# Altium schematic sheet P04_POWER.SchDoc
size 420 x 297 mm
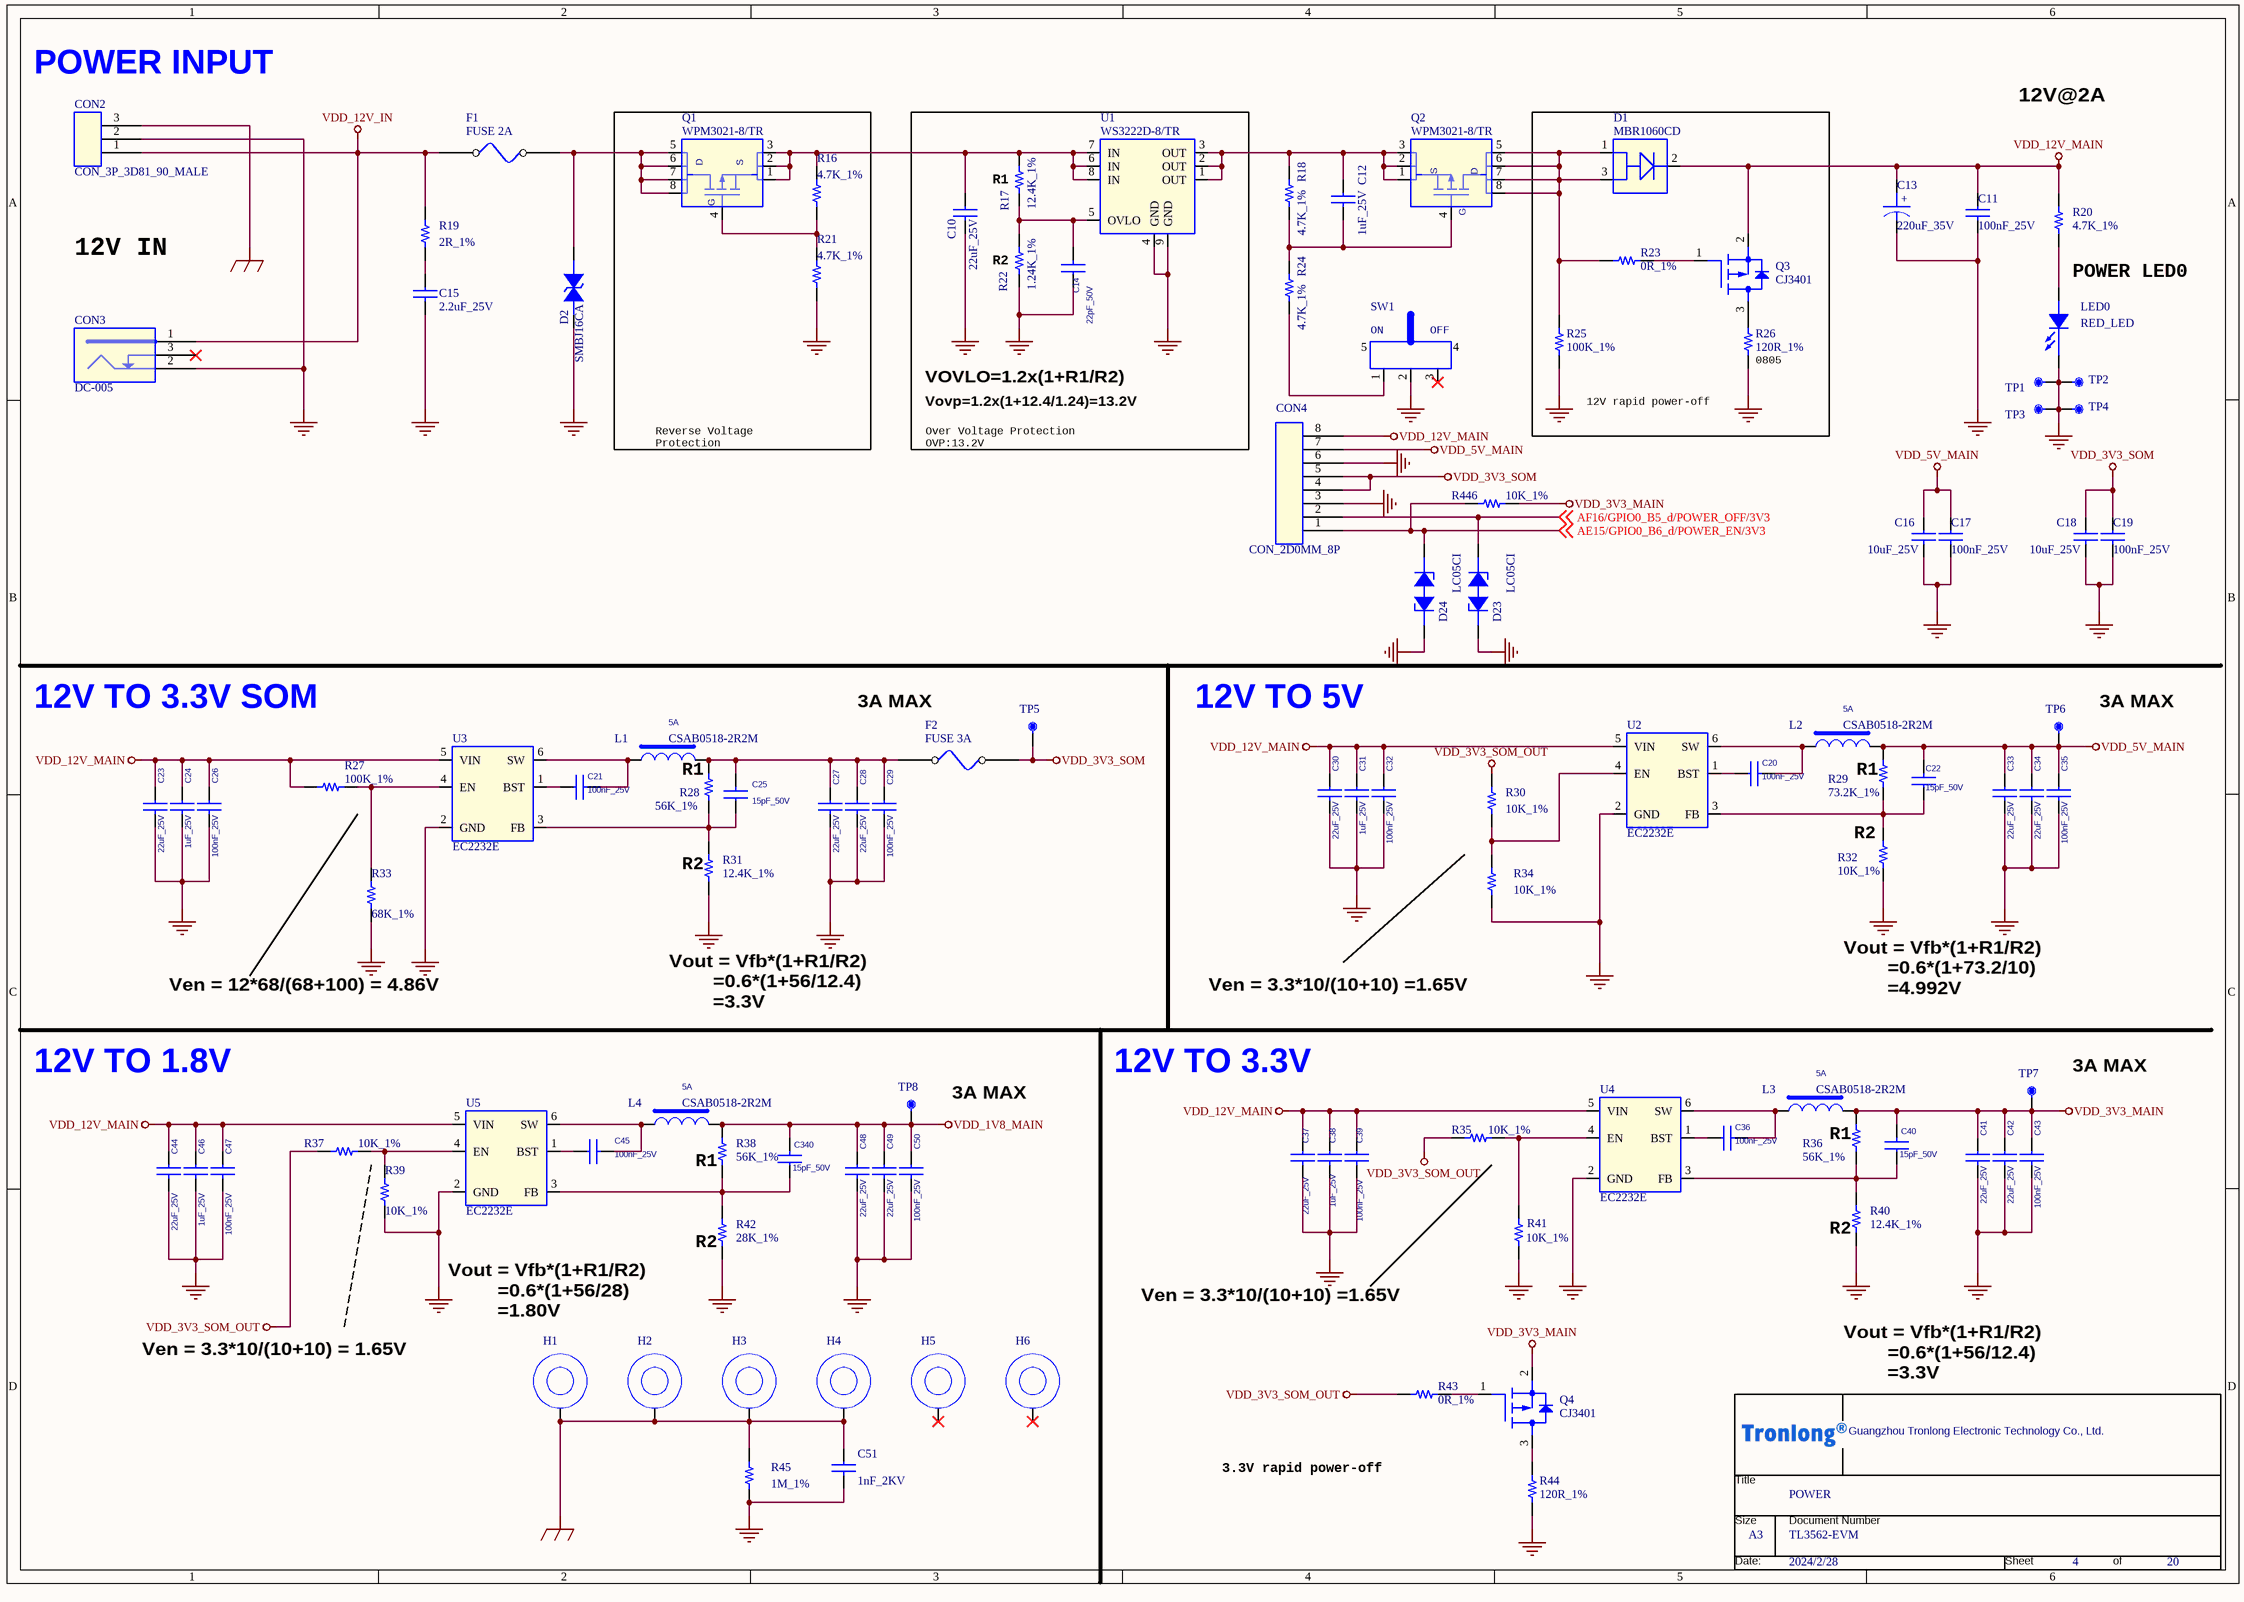
[diagram p0: P04_POWER.SchDoc]

## Parts
*  Page Count: 20  Page Number: 4  Page Size: A3  OrgName: Guangzhou Tronlong Electronic Technology Co., Ltd.  Title: POWER  Doc: TL3562-EVM  Page Modify Date: 2024/2/28  (hidden comment: Tronlong_TITTLE_20211115)  (graphical)
C10  22uF_25V  [C0805]
C11  100nF_25V  [C0402]
C12  1uF_25V  [C0603]
C13  220uF_35V  [cap_alu_smd_8x10d5]
C14  22pF_50V  [C0603]
C15  2.2uF_25V  [C1206]
C16  10uF_25V  [C0603]
C17  100nF_25V  [C0402]
C18  10uF_25V  [C0603]
C19  100nF_25V  [C0402]
C20  100nF_25V  [C0402]
C21  100nF_25V  [C0402]
C22  15pF_50V  [C0402]
C23  22uF_25V  [C0805]
C24  1uF_25V  [C0603]
C25  15pF_50V  [C0402]
C26  100nF_25V  [C0402]
C27  22uF_25V  [C0805]
C28  22uF_25V  [C0805]
C29  100nF_25V  [C0402]
C30  22uF_25V  [C0805]
C31  1uF_25V  [C0603]
C32  100nF_25V  [C0402]
C33  22uF_25V  [C0805]
C34  22uF_25V  [C0805]
C35  100nF_25V  [C0402]
C36  100nF_25V  [C0402]
C37  22uF_25V  [C0805]
C38  1uF_25V  [C0603]
C39  100nF_25V  [C0402]
C40  15pF_50V  [C0402]
C41  22uF_25V  [C0805]
C42  22uF_25V  [C0805]
C43  100nF_25V  [C0402]
C44  22uF_25V  [C0805]
C45  100nF_25V  [C0402]
C46  1uF_25V  [C0603]
C47  100nF_25V  [C0402]
C48  22uF_25V  [C0805]
C49  22uF_25V  [C0805]
C50  100nF_25V  [C0402]
C51  1nF_2KV  [C1210]
C340  15pF_50V  [C0402]
CON2  CON_3P_3D81_90_MALE  [CON_3P_3D81_90_MALE_NEW]
CON3  DC-005  [con_dc005_new]
CON4  CON_2D0MM_8P  [DIP_CON_2D0MM_8P]
D1  MBR1060CD  [TO-252]
D2  SMBJ16CA  [SMB]
D23  LC05CI  [SOD323_BI]
D24  LC05CI  [SOD323_BI]
F1  FUSE 2A  [F1206]
F2  FUSE 3A  [F1206]
H1  HOLE  [MHOLE_C200D125]  (value not drawn)
H2  HOLE  [MHOLE_C200D125]  (value not drawn)
H3  HOLE  [MHOLE_C200D125]  (value not drawn)
H4  HOLE  [MHOLE_C200D125]  (value not drawn)
H5  HOLE  [MHOLE_C200D125]  (value not drawn)
H6  HOLE  [MHOLE_C200D125]  (value not drawn)
L1  CSAB0518-2R2M  Current: 5A  [SMD_CSAB0518]
L2  CSAB0518-2R2M  Current: 5A  [SMD_CSAB0518]
L3  CSAB0518-2R2M  Current: 5A  [SMD_CSAB0518]
L4  CSAB0518-2R2M  Current: 5A  [SMD_CSAB0518]
LED0  RED_LED  [CON_2P_3MM]
Q1  WPM3021-8/TR  [PSOPSOP-8L]
Q2  WPM3021-8/TR  [PSOPSOP-8L]
Q3  CJ3401  [SOT23-3]
Q4  CJ3401  [SOT23-3]
R16  4.7K_1%  [R0402]
R17  12.4K_1%  [R0402]
R18  4.7K_1%  [R0402]
R19  2R_1%  [R1210]
R20  4.7K_1%  [R0402]
R21  4.7K_1%  [R0402]
R22  1.24K_1%  [R0603]
R23  0R_1%  [R0402]
R24  4.7K_1%  [R0402]
R25  100K_1%  [R0402]
R26  120R_1%  [R0805]
R27  100K_1%  [R0402]
R28  56K_1%  [R0402]
R29  73.2K_1%  [R0402]
R30  10K_1%  [R0402]
R31  12.4K_1%  [R0402]
R32  10K_1%  [R0402]
R33  68K_1%  [R0402]
R34  10K_1%  [R0402]
R35  10K_1%  [R0402]
R36  56K_1%  [R0402]
R37  10K_1%  [R0402]
R38  56K_1%  [R0402]
R39  10K_1%  [R0402]
R40  12.4K_1%  [R0402]
R41  10K_1%  [R0402]
R42  28K_1%  [R0402]
R43  0R_1%  [R0402]
R44  120R_1%  [R0805]
R45  1M_1%  [R0603]
R446  10K_1%  [R0402]
SW1  SS-12D11L5  [sw-126_76]  (value not drawn)
TP1  Black Test Point  [TP_DIP]  (value not drawn)
TP2  Black Test Point  [TP_DIP]  (value not drawn)
TP3  Black Test Point  [TP_DIP]  (value not drawn)
TP4  Black Test Point  [TP_DIP]  (value not drawn)
TP5  SMT TP  [TP30]  (value not drawn)
TP6  SMT TP  [TP30]  (value not drawn)
TP7  SMT TP  [TP30]  (value not drawn)
TP8  SMT TP  [TP30]  (value not drawn)
U1  WS3222D-8/TR  [DFN2X2-8L]
U2  EC2232E  [SOT-23-6L]
U3  EC2232E  [SOT-23-6L]
U4  EC2232E  [SOT-23-6L]
U5  EC2232E  [SOT-23-6L]

## Blocks framed on the sheet
VOVLO=1.2x(1+R1/R2): C10 C14 R17 R22 U1

## Nets
EGND: C51.1 CON2.3 H1.1 H2.1 H3.1 H4.1 R45.1
GND: C10.2 C11.2 C13.2 C14.1 C15.2 C16.2 C17.2 C18.2 C19.2 C23.2 C24.2 C26.2 C27.2 C28.2 C29.2 C30.2 C31.2 C32.2 C33.2 C34.2 C35.2 C37.2 C38.2 C39.2 C41.2 C42.2 C43.2 C44.2 C46.2 C47.2 C48.2 C49.2 C50.2 C51.2 CON2.2 CON3.2 CON4.3 CON4.6 D2.1 D23.2(CATHODE2) D24.2(CATHODE2) LED0.2(CATHODE) R21.1 R22.2 R25.1 R26.2 R31.1 R32.1 R33.1 R34.1 R39.1 R40.1 R41.1 R42.1 R44.2 R45.2 SW1.2 TP1.1 TP2.1 TP3.1 TP4.1 U1.4(GND) U1.9(GND) U2.2(GND) U3.2(GND) U4.2(GND) U5.2(GND)
VDD_1V8_MAIN: C48.1 C49.1 C50.1 C340.2 L4.2 R38.2 TP8.1
VDD_3V3_MAIN: C40.2 C41.1 C42.1 C43.1 L3.2 Q4.2(SOURCE) R36.2 R446.1 TP7.1
VDD_3V3_SOM: C18.1 C19.1 CON4.4 CON4.5 F2.2 TP5.1
VDD_3V3_SOM_OUT: R30.2 R35.2 R37.1 R43.2
VDD_5V_MAIN: C16.1 C17.1 C22.2 C33.1 C34.1 C35.1 CON4.7 L2.2 R29.2 TP6.1
VDD_12V_IN: CON2.1 CON3.1 F1.1 R19.2
VDD_12V_MAIN: C11.1 C13.1 C23.1 C24.1 C26.1 C30.1 C31.1 C32.1 C37.1 C38.1 C39.1 C44.1 C46.1 C47.1 CON4.8 D1.2 Q3.2(SOURCE) R20.1 R27.1 U2.5(VIN) U3.5(VIN) U4.5(VIN) U5.5(VIN)
AE15/GPIO0_B6_d/POWER_EN/3V3: CON4.1 D24.1(ANODE1) R446.2 ; off-sheet AE15/GPIO0_B6_d/POWER_EN/3V3
AF16/GPIO0_B5_d/POWER_OFF/3V3: CON4.2 D23.1(ANODE1) ; off-sheet AF16/GPIO0_B5_d/POWER_OFF/3V3
NetC10_1: C10.1 Q1.1(S1) Q1.2(S2) Q1.3(S3) R16.2 R17.1 U1.6(IN) U1.7(IN) U1.8(IN)
NetC12_1: C12.1 Q2.1(S1) Q2.2(S2) Q2.3(S3) R18.2 U1.1(OUT) U1.2(OUT) U1.3(OUT)
NetC12_2: C12.2 Q2.4(G) R18.1 R24.2
NetC14_2: C14.2 R17.2 R22.1 U1.5(OVLO)
NetC15_1: C15.1 R19.1
NetC20_1: C20.1 U2.1(BST)
NetC20_2: C20.2 L2.1 U2.6(SW)
NetC21_1: C21.1 U3.1(BST)
NetC21_2: C21.2 L1.1 U3.6(SW)
NetC22_1: C22.1 R29.1 R32.2 U2.3(FB)
NetC25_1: C25.1 R28.1 R31.2 U3.3(FB)
NetC25_2: C25.2 C27.1 C28.1 C29.1 F2.1 L1.2 R28.2
NetC36_1: C36.1 U4.1(BST)
NetC36_2: C36.2 L3.1 U4.6(SW)
NetC40_1: C40.1 R36.1 R40.2 U4.3(FB)
NetC45_1: C45.1 U5.1(BST)
NetC45_2: C45.2 L4.1 U5.6(SW)
NetC340_1: C340.1 R38.1 R42.2 U5.3(FB)
NetD1_1: D1.1 D1.3 Q2.5(D1) Q2.6(D2) Q2.7(D3) Q2.8(D4) R23.2 R25.2
NetD2_2: D2.2 F1.2 Q1.5(D1) Q1.6(D2) Q1.7(D3) Q1.8(D4)
NetLED0_1: LED0.1(ANODE) R20.2
NetQ1_4: Q1.4(G) R16.1 R21.2
NetQ3_1: Q3.1(GATE) R23.1
NetQ3_3: Q3.3(DRAIN) R26.1
NetQ4_1: Q4.1(GATE) R43.1
NetQ4_3: Q4.3(DRAIN) R44.1
NetR24_1: R24.1 SW1.1
NetR27_2: R27.2 R33.2 U3.4(EN)
NetR30_1: R30.1 R34.2 U2.4(EN)
NetR35_1: R35.1 R41.2 U4.4(EN)
NetR37_2: R37.2 R39.2 U5.4(EN)

Not connected (* = marked no-connect by the designer): CON3 3*; H5 1*; H6 1*; SW1 3* 4 5

## Notes on the sheet
- (near CON2) POWER INPUT
- 12V@2A
- (near R17) R1
- 12V IN
- (near R22) R2
- POWER LED0
- (near R26) 0805
- Reverse Voltage
  Protection
- Over Voltage Protection
  OVP:13.2V
- Vovp=1.2x(1+12.4/1.24)=13.2V
- 12V rapid power-off
- 12V TO 3.3V SOM
- 3A MAX
- 12V TO 5V
- (near TP6) 3A MAX
- (near L1) R1
- R1
- (near R32) R2
- (near R31) R2
- Ven = 12*68/(68+100) = 4.86V
- Ven = 3.3*10/(10+10) =1.65V
- Vout = Vfb*(1+R1/R2)
  =0.6*(1+73.2/10)
  =4.992V
- Vout = Vfb*(1+R1/R2)
  =0.6*(1+56/12.4)
  =3.3V
- (near TP7) 3A MAX
- 12V TO 1.8V
- (near TP8) 3A MAX
- 12V TO 3.3V
- (near R38) R1
- (near R42) R2
- (near R40) R2
- (near R42) Vout = Vfb*(1+R1/R2)
  =0.6*(1+56/28)
  =1.80V
- Ven = 3.3*10/(10+10) = 1.65V
- 3.3V rapid power-off
- (in symbol CAP POL_Dup1) +
- (in symbol switch_7) ON; OFF
- (in symbol Tronlong_TITTLE_20211115) Title; Size; Document Number; Date:; Sheet; of
- (in symbol WPM3021) S; D

## Library data of the parts
* = Tronlong_TITTLE_20211115: RevCode: A?; Page Create Date: March  8, 1995
C10 C37 C41 C42 = CAP NP_Dup3: 贴片陶瓷电容,22uF,20%,25V,X5R; Manufacturer Character: 中国大陆; Operation Temperature（℃）: -55~85℃; As-Welded: /; Temperature: -55~125℃; PCB Footprint: C0805
C11 = CAP NP_Dup3: 贴片陶瓷电容,100nF,10%,25V,X5R; Manufacturer Character: 中国大陆; As-Welded: /; Operation Temperature（℃）: -55~85℃; room: DCIN; Temperature: -55~125℃; PCB Footprint: C0402
C12 C38 = CAP NP_Dup3: 贴片陶瓷电容,1uF,10%,25V,X5R; Manufacturer Character: 中国大陆; As-Welded: /; Operation Temperature（℃）: -55~85℃; PCB Footprint: C0603
C13 = CAP POL_Dup1: 贴片式铝电解电容,220uF,20%,35V; Manufacturer PartNumber: RVT1V221M0810VG; Manufacturer: 东莞市合粤电子有限公司（Heyue）; Manufacturer Character: 中国大陆; As-Welded: /; room: DCIN; Operation Temperature（℃）: -55~105℃; Temperature: -55~105℃; PCB Footprint: cap_alu_smd_8x10d5
C14 = CAP NP_Dup3: 贴片陶瓷电容,22pF,5%,50V,C0G; Manufacturer Character: 中国大陆; As-Welded: /; Operation Temperature（℃）: -55~125℃; Temperature: -55~125℃; PCB Footprint: C0603
C15 = CAP NP_Dup3: 贴片陶瓷电容,2.2uF,20%,25V,Y5V; Manufacturer Character: 中国大陆; As-Welded: /; Operation Temperature（℃）: -20~85℃; PCB Footprint: C1206
C16 C18 = CAP NP_Dup3: 贴片陶瓷电容,10uF,10%,10V,X5R; Manufacturer Character: 中国大陆; As-Welded: /; Operation Temperature（℃）: -55~85℃; PCB Footprint: C0603
C17 C19-C21 C26 C29 C32 C35 = CAP NP_Dup3: 贴片陶瓷电容,100nF,10%,25V,X5R; Manufacturer Character: 中国大陆; Operation Temperature（℃）: -55~85℃; As-Welded: /; PCB Footprint: C0402
  C20 C21 C26 C29 C32 C35: Temperature: -55~125℃
C22 C25 C340 = CAP NP_Dup3: 贴片陶瓷电容,15pF,5%,50V,COG; Manufacturer Character: 中国大陆; Operation Temperature（℃）: -55~125℃; As-Welded: /; Temperature: -55~125℃; PCB Footprint: C0402
C23 C27 C28 C30 C33 C34 C48 C49 = CAP NP_Dup3: 贴片陶瓷电容,22uF,20%,25V,X5R; Manufacturer Character: 中国大陆; As-Welded: /; Operation Temperature（℃）: -55~85℃; Temperature: -55~125℃; PCB Footprint: C0805
C24 C31 = CAP NP_Dup3: 贴片陶瓷电容,1uF,10%,25V,X5R; Manufacturer Character: 中国大陆; Operation Temperature（℃）: -55~85℃; As-Welded: /; PCB Footprint: C0603
C36 C39 C43 = CAP NP_Dup3: 贴片陶瓷电容,100nF,10%,25V,X5R; Manufacturer Character: 中国大陆; As-Welded: /; Operation Temperature（℃）: -55~85℃; Temperature: -55~125℃; PCB Footprint: C0402
C40 = CAP NP_Dup3: 贴片陶瓷电容,15pF,5%,50V,COG; Manufacturer Character: 中国大陆; As-Welded: /; Operation Temperature（℃）: -55~125℃; PCB Footprint: C0402; Temperature: -55~125℃
C44 = CAP NP_Dup3: 贴片陶瓷电容,22uF,20%,25V,X5R; Manufacturer Character: 中国大陆; Operation Temperature（℃）: -55~85℃; Characteristic: <Characteristic>; As-Welded: /; Temperature: -55~155℃; PCB Footprint: C0805
C45 C47 = CAP NP_Dup3: 贴片陶瓷电容,100nF,10%,25V,X5R; Manufacturer Character: 中国大陆; As-Welded: /; Operation Temperature（℃）: -55~85℃; Characteristic: <Characteristic>; Temperature: -55~155℃; PCB Footprint: C0402
C46 = CAP NP_Dup3: 贴片陶瓷电容,1uF,10%,25V,X5R; Manufacturer Character: 中国大陆; As-Welded: /; Characteristic: <Characteristic>; Operation Temperature（℃）: -55~85℃; PCB Footprint: C0603
C50 = CAP NP_Dup3: 贴片陶瓷电容,100nF,10%,25V,X5R; Manufacturer Character: 中国大陆; Characteristic: <Characteristic>; Operation Temperature（℃）: -55~85℃; As-Welded: /; Temperature: -55~155℃; PCB Footprint: C0402
C51 = CAP NP_Dup3: 贴片陶瓷电容,1nF,10%,2KV,X7R; Manufacturer Character: 中国大陆; As-Welded: /; Operation Temperature（℃）: -55~125℃; Temperature: –55~125℃; PCB Footprint: C1210
CON2 = CON3_Dup1: 端子座,3PIN,间距3.81MM,90度,绿色,插件; Manufacturer PartNumber: KF2EDGR-3.81-03P-14; Manufacturer: 慈溪市科发电子有限公司（KEFA）; Manufacturer Character: 中国大陆; As-Welded: /; room: 17; Operation Temperature（℃）: -40~105℃; PCB Footprint: CON_3P_3D81_90_MALE_NEW
CON3 = DC-005: DC-005,3PIN,90度,母座,2.0MM内径,插件; Manufacturer Character: 中国大陆; Manufacturer: 广东纳特康电子股份有限公司(natconn); Manufacturer PartNumber: 305-OT03SZD001; As-Welded: /; Operation Temperature（℃）: -30~70℃; room: dcin; Temperature: -30~70; PCB Footprint: con_dc005_new
CON4 = CON8: 端子座,1x8PIN,间距2.00MM,180度,插件; Manufacturer: 深圳市长江连接器有限公司（CJT）; Manufacturer Character: 中国大陆; Manufacturer PartNumber: A2001WV-8P-3; As-Welded: /; Operation Temperature（℃）: -40~105℃; PCB Footprint: DIP_CON_2D0MM_8P
D1 = MBRB1045_0: 肖特基二极管,VR=60V,IF=10A,VF=0.75V@5A,两路; Manufacturer Character: 中国大陆; Manufacturer: 辽宁芯诺电子科技有限公司（XINNUO）; Operation Temperature（℃）: -55~150℃; As-Welded: /; PCB Footprint: TO-252; Manufacturer PartNumber: MBR1060CD; Temperature: -55~150℃
D2 = DIODE-TRIG: TVS二极管,VRWM=16V,VBR=17.8V,一组,双向; Manufacturer Character: 中国大陆; Manufacturer: 江苏长晶科技有限公司（JSCJ）; As-Welded: /; Operation Temperature（℃）: -55~150℃; room: DCIN; Temperature: -55~150℃; Manufacturer PartNumber: SMBJ16CA; PCB Footprint: SMB
D23 D24 = DIODE BREAKDOWN_2: TVS二极管,VRWM=5V,VBR=6V,一组,双向,30KV,30KV; Manufacturer Part Number: PESD3V3L1BA; Manufacturer: 上海雷卯电子科技有限公司（Leiditech）; Manufacturer Character: 中国大陆; As-Welded: /; Operation Temperature（℃）: -55~125℃; room: KEY; Temperature: -55~155℃; Manufacturer PartNumber: LC05CI; PCB Footprint: SOD323_BI
F1 = FUSE: 保险丝，Vmax=72V,Imax=50A,Ihold=2A; Manufacturer PartNumber: F12T2; Manufacturer: 东莞市竞沃电子科技有限公司（TLC）; Manufacturer Character: 中国大陆; Operation Temperature（℃）: -55~125℃; As-Welded: /; PCB Footprint: F1206; Temperature: -55~125℃
F2 = FUSE: 保险丝，Vmax=72V,Imax=50A,Ihold=3A; Manufacturer PartNumber: F12T3; Manufacturer: 东莞市竞沃电子科技有限公司（TLC）; Manufacturer Character: 中国大陆; As-Welded: /; Operation Temperature（℃）: -55~125℃; Temperature: -55~125℃; PCB Footprint: F1206
H1-H6 = HOLE: Manufacturer Character: 中国大陆; As-Welded: DNP; PCB Footprint: MHOLE_C200D125
L1 L2 = INDUCTOR: 贴片功率电感,2.2uH,0.035Ω,Isat=6.5A,Irms=5A; Manufacturer Character: 中国大陆; Manufacturer: 深圳市科达嘉电子有限公司（CODACA）; Parameter: L2520，奇力新一体成型电感，最大额定电流3A，内阻65毫欧，20%; As-Welded: /; Operation Temperature（℃）: -40~125℃; Temperature: -40~125℃; Manufacturer PartNumber: CSAB0518-2R2M; PCB Footprint: SMD_CSAB0518
L3 = INDUCTOR: 贴片功率电感,2.2uH,0.035Ω,Isat=6.5A,Irms=5A; Manufacturer: 深圳市科达嘉电子有限公司（CODACA）; Manufacturer Character: 中国大陆; Parameter: L2520，奇力新一体成型电感，最大额定电流3A，内阻65毫欧，20%; Operation Temperature（℃）: -40~125℃; As-Welded: /; PCB Footprint: SMD_CSAB0518; Manufacturer PartNumber: CSAB0518-2R2M; Temperature: -40~125℃
L4 = INDUCTOR: 贴片功率电感,2.2uH,0.035Ω,Isat=6.5A,Irms=5A; Manufacturer Character: 中国大陆; Manufacturer: 深圳市科达嘉电子有限公司（CODACA）; Parameter: L2520，奇力新一体成型电感，最大额定电流3A，内阻65毫欧，20%; Operation Temperature（℃）: -40~125℃; As-Welded: /; PCB Footprint: SMD_CSAB0518; Manufacturer PartNumber: CSAB0518-2R2M; Temperature: -40~125℃
LED0 = LED: 直插式发光二极管,红色,带灯座; Manufacturer PartNumber: JH-03B2RD1E-DL; Manufacturer: 深圳市巨弘光电有限公司（JUHLIGHT）; Manufacturer Character: 中国大陆; Operation Temperature（℃）: -40~100℃; As-Welded: /; PCB Footprint: CON_2P_3MM; room: LED; Temperature: -40~105℃
Q1 = WPM3021: MOSFET,P沟道,VDSS=-30V,VGSS=±25V,ID=-13A,PD=3.8W,VGS(th)=-3V; Manufacturer Character: 中国大陆; Manufacturer: 上海韦尔半导体股份有限公司（WILLSEMI）; Operation Temperature（℃）: -55~150℃; As-Welded: /; PCB Footprint: PSOPSOP-8L; Manufacturer PartNumber: WPM3021-8/TR; Temperature: -40~85℃
Q2 = WPM3021: MOSFET,P沟道,VDSS=-30V,VGSS=±25V,ID=-13A,PD=3.8W,VGS(th)=-3V; Manufacturer: 上海韦尔半导体股份有限公司（WILLSEMI）; Manufacturer Character: 中国大陆; Operation Temperature（℃）: -55~150℃; As-Welded: /; PCB Footprint: PSOPSOP-8L; Temperature: -40~85℃; Manufacturer PartNumber: WPM3021-8/TR
Q3 Q4 = MOSFET P SOT_Dup1: MOSFET,P沟道,VDSS=-30V,VGSS=±12V,ID=-4.2A,PD=0.35W,VGS(th)=-1.3V; Manufacturer: 江苏长晶科技有限公司（JSCJ）; Manufacturer Character: 中国大陆; room: DCIN; Operation Temperature（℃）: -55~150℃; As-Welded: /; PCB Footprint: SOT23-3; Temperature: -55~150℃; Manufacturer Part Number: CJ3401; Manufacturer PartNumber: CJ3401
R16 R18 R24 = Resistor_Dup3: 贴片电阻,4.7K,±1%,1/16W; Manufacturer Character: 中国大陆; CLASS: DISCRETE; As-Welded: /; Operation Temperature（℃）: -55~155℃; Temperature: -55~155℃; PCB Footprint: R0402
R17 = Resistor_Dup3: 贴片电阻,12.4K,±1%,1/16W; Manufacturer Character: 中国大陆; CLASS: DISCRETE; Operation Temperature（℃）: -55~155℃; As-Welded: /; Temperature: -55~155℃; PCB Footprint: R0402
R19 = Resistor_Dup3: 贴片电阻,2R,±1%,1/3W; Manufacturer Character: 中国大陆; CLASS: DISCRETE; As-Welded: /; Operation Temperature（℃）: -55~155℃; PCB Footprint: R1210
R20 = Resistor_Dup3: 贴片电阻,4.7K,±1%,1/16W; Manufacturer Character: 中国大陆; CLASS: DISCRETE; As-Welded: /; room: DCIN; Operation Temperature（℃）: -55~155℃; PCB Footprint: R0402
R21 = Resistor_Dup3: 贴片电阻,4.7K,±1%,1/16W; Manufacturer Character: 中国大陆; CLASS: DISCRETE; Operation Temperature（℃）: -55~155℃; As-Welded: /; Temperature: -55~155℃; PCB Footprint: R0402
R22 = Resistor_Dup3: 贴片电阻,12.4K,±1%,1/10W; Manufacturer Character: 中国大陆; CLASS: DISCRETE; As-Welded: /; Operation Temperature（℃）: -55~155℃; PCB Footprint: R0603
R23 R43 = Resistor_Dup3: 0R,±1%,R0402,≥1/16W; Manufacturer Character: 中国大陆; CLASS: DISCRETE; As-Welded: /; Operation Temperature（℃）: -55~155℃; PCB Footprint: R0402
R25 = Resistor_Dup3: 贴片电阻,100K,±1%,1/16W; Manufacturer Character: 中国大陆; CLASS: DISCRETE; As-Welded: /; Operation Temperature（℃）: -55~155℃; PCB Footprint: R0402; Temperature: -55~155℃
R26 = Resistor_Dup3: 贴片电阻,120R,±1%,1/8W; Manufacturer Character: 中国大陆; CLASS: DISCRETE; As-Welded: /; Operation Temperature（℃）: -55~155℃; room: DCIN; Temperature: -55~155℃; PCB Footprint: R0805
R27 = Resistor_Dup3: 贴片电阻,100K,±1%,1/16W; Manufacturer Character: 中国大陆; CLASS: DISCRETE; Operation Temperature（℃）: -55~155℃; As-Welded: /; Temperature: -55~155℃; PCB Footprint: R0402
R28 = Resistor_Dup3: 贴片电阻,56K,±1%,1/16W; Manufacturer Character: 中国大陆; CLASS: DISCRETE; Operation Temperature（℃）: -55~155℃; As-Welded: /; Temperature: -55~155℃; PCB Footprint: R0402
R29 = Resistor_Dup3: 贴片电阻,73.2K,±1%,1/16W; Manufacturer Character: 中国大陆; CLASS: DISCRETE; Operation Temperature（℃）: -55~155℃; As-Welded: /; Temperature: -55~155℃; PCB Footprint: R0402
R30 R32 R34 = Resistor_Dup3: 贴片电阻,10K,±1%,1/16W; Manufacturer Character: 中国大陆; CLASS: DISCRETE; As-Welded: /; Operation Temperature（℃）: -55~155℃; PCB Footprint: R0402
  R30 R34: Temperature: –55~155℃
  R32: Temperature: -55~155℃
R31 R40 = Resistor_Dup3: 贴片电阻,12.4K,±1%,1/16W; Manufacturer Character: 中国大陆; CLASS: DISCRETE; As-Welded: /; Operation Temperature（℃）: -55~155℃; Temperature: -55~155℃; PCB Footprint: R0402
R33 = Resistor_Dup3: 贴片电阻,68K,±1%,1/16W; Manufacturer Character: 中国大陆; CLASS: DISCRETE; Operation Temperature（℃）: -55~155℃; As-Welded: /; Temperature: -55~155℃; PCB Footprint: R0402
R35 R37 R39 R41 R446 = Resistor_Dup3: 贴片电阻,10K,±1%,1/16W; Manufacturer Character: 中国大陆; CLASS: DISCRETE; Operation Temperature（℃）: -55~155℃; As-Welded: /; PCB Footprint: R0402
  R35 R41: Temperature: –55~155℃
  R37 R39 R446: Temperature: -55~155℃
R36 R38 = Resistor_Dup3: 贴片电阻,56K,±1%,1/16W; Manufacturer Character: 中国大陆; CLASS: DISCRETE; As-Welded: /; Operation Temperature（℃）: -55~155℃; Temperature: -55~155℃; PCB Footprint: R0402
R42 = Resistor_Dup3: 28K,±1%,R0402,≥1/16W; Manufacturer Character: 中国大陆; CLASS: DISCRETE; As-Welded: /; Operation Temperature（℃）: -40~85℃; Temperature: -55~155℃; PCB Footprint: R0402
R44 = Resistor_Dup3: 贴片电阻,120R,±1%,1/8W; Manufacturer Character: 中国大陆; CLASS: DISCRETE; As-Welded: /; room: DCIN; Operation Temperature（℃）: -55~155℃; Temperature: -55~155℃; PCB Footprint: R0805
R45 = Resistor_Dup3: 贴片电阻,1M,±1%,1/10W; Manufacturer Character: 中国大陆; CLASS: DISCRETE; As-Welded: /; room: USB HUB; Operation Temperature（℃）: -55~155℃; PCB Footprint: R0603
SW1 = switch_7: 拨动开关，2档3脚侧拨开关,黑色,90度,短柄; Manufacturer: 广东星坤科技股份有限公司（XKB）; Manufacturer Character: 中国大陆; As-Welded: /; PCB Footprint: sw-126_76; Manufacturer PartNumber: SS-12D11L5
TP1 TP3 = TP-S40: 黑色直插测试柱; Manufacturer: 深圳市保定五金塑胶有限公司; Manufacturer PartNumber: TP-5011; Manufacturer Character: 中国大陆; Characteristic: Test point,diameter=1.0mm; Operation Temperature（℃）: -40~85℃; As-Welded: /; PCB Footprint: TP_DIP
TP2 = TP-S40: 黑色直插测试柱; Manufacturer PartNumber: TP-5011; Manufacturer: 深圳市保定五金塑胶有限公司; Manufacturer Character: 中国大陆; Characteristic: Test point,diameter=1.0mm; Operation Temperature（℃）: -40~85℃; As-Welded: /; PCB Footprint: TP_DIP
TP4 = TP-S40: 黑色直插测试柱; Manufacturer Character: 中国大陆; Manufacturer: 深圳市保定五金塑胶有限公司; Manufacturer PartNumber: TP-5011; Characteristic: Test point,diameter=1.0mm; Operation Temperature（℃）: -40~85℃; As-Welded: /; PCB Footprint: TP_DIP
TP5-TP8 = TP-S40: Manufacturer Character: 中国大陆; Characteristic: Test point,diameter=1.0mm; As-Welded: /; PCB Footprint: TP30
U1 = WS3222D-8/TR: MOSFET,P沟道,VDSS=-30V,VGSS=±25V,ID=-13A,PD=3.8W,VGS(th)=-3V; Manufacturer Character: 中国大陆; Manufacturer: 上海韦尔半导体股份有限公司（WILLSEMI）; As-Welded: /; Operation Temperature（℃）: -40~85℃; PCB Footprint: DFN2X2-8L; Temperature: -40~85℃; Manufacturer PartNumber: WS3222D-8/TR
U2 U3 = WD1304E30: DC/DC,Buck,Vin:4.5V~17V,Vout:0.6V~6V,3A,1·; Manufacturer: 上海芯强微电子股份有限公司（Ecranic）; Manufacturer Character: 中国大陆; As-Welded: /; Operation Temperature（℃）: -40~85℃; Manufacturer PartNumber: EC2232E; Temperature: -40~85℃; PCB Footprint: SOT-23-6L
U4 = WD1304E30: DC/DC,Buck,Vin:4.5V~17V,Vout:0.6V~6V,3A,1·; Manufacturer: 上海芯强微电子股份有限公司（Ecranic）; Manufacturer Character: 中国大陆; Operation Temperature（℃）: -40~85℃; As-Welded: /; PCB Footprint: SOT-23-6L; Temperature: -40~85℃; Manufacturer PartNumber: EC2232E
U5 = WD1304E30_0: DC/DC,Buck,Vin:4.5V~17V,Vout:0.6V~6V,3A,1·; Manufacturer Character: 中国大陆; Manufacturer: 上海芯强微电子股份有限公司（Ecranic）; Operation Temperature（℃）: -40~85℃; As-Welded: /; PCB Footprint: SOT-23-6L; Temperature: -40~125℃; Manufacturer PartNumber: EC2232E